# EAGLE design recco-rig (EAGLE 9.6.1)
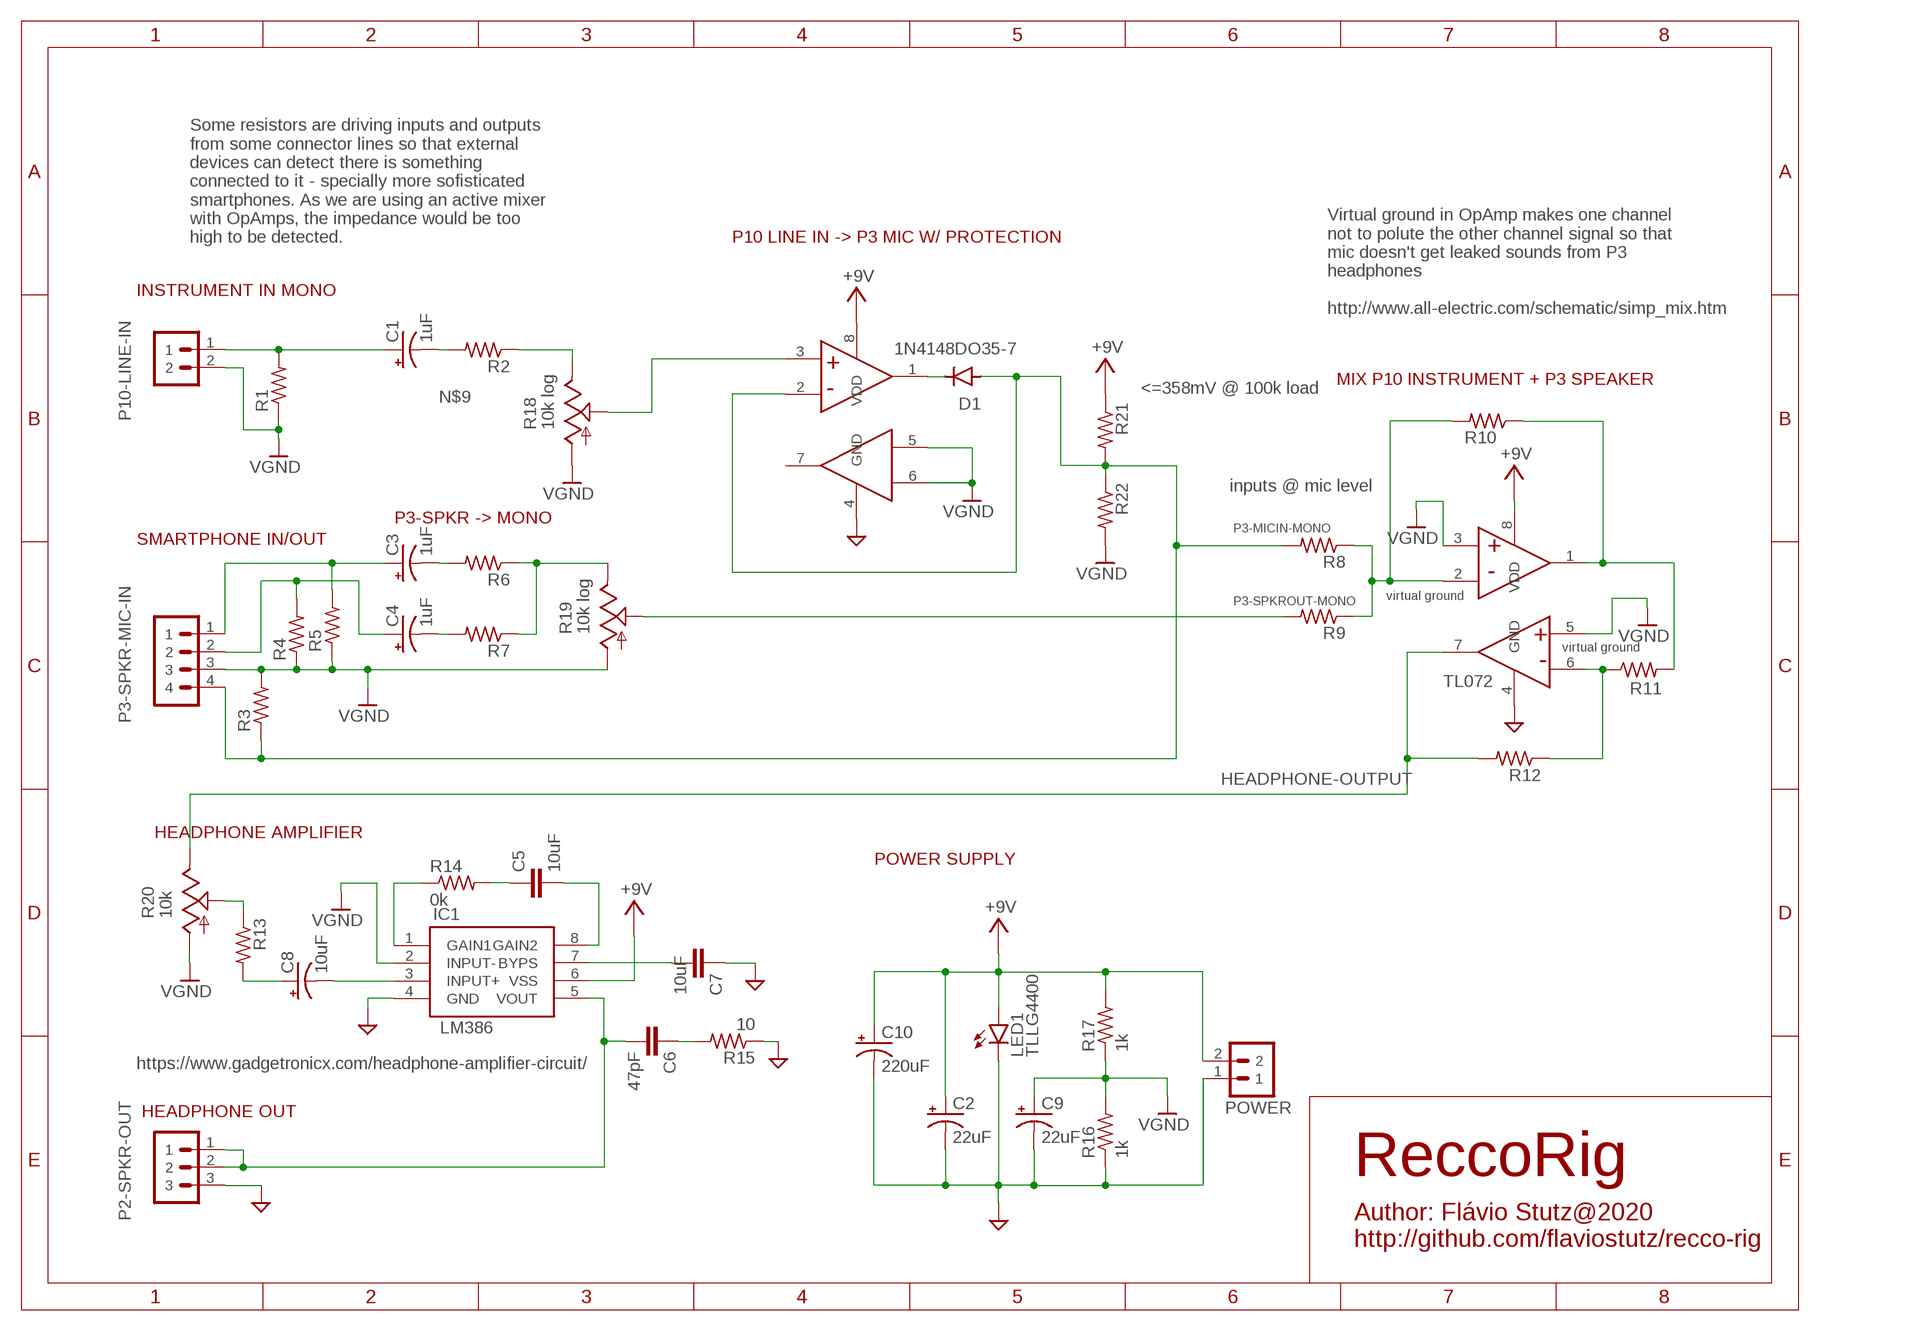
[diagram p0: schematic, sheet 1]

## Parts
C1  1uF  CPOL-USE2,5-6E  [E2,5-6E]
C2  22uF  CPOL-USE2,5-6E  [E2,5-6E]
C3  1uF  CPOL-USE2,5-6E  [E2,5-6E]
C4  1uF  CPOL-USE2,5-6E  [E2,5-6E]
C5  10uF  C-EU050-024X044  [C050-024X044]
C6  47pF  C-EU050-024X044  [C050-024X044]
C7  10uF  C-EU050-024X044  [C050-024X044]
C8  10uF  CPOL-USE2,5-6E  [E2,5-6E]
C9  22uF  CPOL-USE2,5-6E  [E2,5-6E]
C10  220uF  CPOL-USE2,5-6E  [E2,5-6E]
D1  1N4148DO35-7  [DO35-7]
IC1  LM386  [PDIP-8PIN]
IC2  TL072-OPAMP  [PDIP-8PIN]
LED1  TLLG4400  [LED3MM]
P2-SPKR-OUT  PIN-HEADER-3PIN  [PIN-HEADER-3PIN]
P3-SPKR-MIC-IN  PIN-HEADER-4PIN  [PIN-HEADER-4PIN]
P10-LINE-IN  PIN-HEADER-2PIN  [PIN-HEADER-2PIN]
POWER  PIN-HEADER-2PIN  [PIN-HEADER-2PIN]
R1  10k  RESISTORV1  [RESISTOR-V1]
R2  300  RESISTORV1  [RESISTOR-V1]
R3  1k  RESISTORV1  [RESISTOR-V1]
R4  1k  RESISTORV1  [RESISTOR-V1]
R5  1k  RESISTORV1  [RESISTOR-V1]
R6  300  RESISTORV1  [RESISTOR-V1]
R7  300  RESISTORV1  [RESISTOR-V1]
R8  10k  RESISTORV1  [RESISTOR-V1]
R9  10k  RESISTORV1  [RESISTOR-V1]
R10  10k  RESISTORV1  [RESISTOR-V1]
R11  10k  RESISTORV1  [RESISTOR-V1]
R12  10k  RESISTORV1  [RESISTOR-V1]
R13  100  RESISTORV1  [RESISTOR-V1]
R14  0k  R-US_0309/V  [0309V]
R15  10  R-US_0309/V  [0309V]
R16  1k  R-US_0309/V  [0309V]
R17  1k  R-US_0309/V  [0309V]
R18  10k log  TRIM_US-B25U  [B25U]
R19  10k log  TRIM_US-B25U  [B25U]
R20  10k  TRIM_US-B25U  [B25U]
R21  10k  RESISTORV1  [RESISTOR-V1]
R22  1k  RESISTORV1  [RESISTOR-V1]
U$12  TL072-OPAMP  [PDIP-8PIN]

## Nets
+9V [power]: C2.+ C10.+ IC1.6(VSS) IC2.8(VDD) LED1.A POWER.2 R17.2 R21.1 U$12.8(VDD)
GND [power]: C2.- C7.1 C9.- C10.- IC1.4(GND) IC2.4(GND) LED1.K(C) P2-SPKR-OUT.3 POWER.1 R15.1 R16.1 U$12.4(GND)
HEADPHONE-OUTPUT: IC2.7(2OUT) R12.2 R20.E
N$1: C1.- R2.2
N$2: C3.- R6.2
N$3: C4.- R7.2
N$4: IC2.2(1IN-) R8.1 R9.1 R10.2
N$5: IC2.1(1OUT) R10.1 R11.2
N$6: IC2.6(2IN-) R11.1 R12.1
N$7: C6.1 R15.2
N$8: C3.+ P3-SPKR-MIC-IN.1 R5.2
N$9: R2.1 R18.E
N$10: C8.+ R13.2
N$11: R13.1 R20.S
N$12: C5.2 IC1.8(GAIN2)
N$13: C5.1 R14.2
N$14: IC1.1(GAIN1) R14.1
N$15: C6.2 IC1.5(VOUT) P2-SPKR-OUT.1 P2-SPKR-OUT.2
N$16: C7.2 IC1.7(BYPS)
N$17: C8.- IC1.3(INPUT+)
N$18: R6.1 R7.1 R19.E
N$19: R18.S U$12.3(1IN+)
N$21: D1.C U$12.1(1OUT)
P3-MICIN-MONO: D1.A P3-SPKR-MIC-IN.4 R3.1 R8.2 R21.2 R22.1 U$12.2(1IN-)
P3-SPKROUT-MONO: R9.2 R19.S
P3-SPKROUT-R: C4.+ P3-SPKR-MIC-IN.2 R4.2
P10-LINEIN-MONO: C1.+ P10-LINE-IN.1 R1.2
VGND [power]: C9.+ IC1.2(INPUT-) IC2.3(1IN+) IC2.5(2IN+) P3-SPKR-MIC-IN.3 P10-LINE-IN.2 R1.1 R3.2 R4.1 R5.1 R16.2 R17.1 R18.A R19.A R20.A R22.2 U$12.5(2IN+) U$12.6(2IN-)
Unconnected: U$12.7(2OUT)

## Notes on the sheet
- Some resistors are driving inputs and outputs
  from some connector lines so that external
  devices can detect there is something
  connected to it - specially more sofisticated
  smartphones. As we are using an active mixer
  with OpAmps, the impedance would be too
  high to be detected.
- P10 LINE IN -> P3 MIC W/ PROTECTION
- INSTRUMENT IN MONO
- Virtual ground in OpAmp makes one channel
  not to polute the other channel signal so that
  mic doesn't get leaked sounds from P3
  headphones
  
  http://www.all-electric.com/schematic/simp_mix.htm
- +
- MIX P10 INSTRUMENT + P3 SPEAKER
- - | <=358mV @ 100k load
- inputs @ mic level
- P3-SPKR -> MONO
- SMARTPHONE IN/OUT
- +
- -
- virtual ground
- +
- virtual ground
- -
- TL072
- HEADPHONE AMPLIFIER
- POWER SUPPLY
- https://www.gadgetronicx.com/headphone-amplifier-circuit/
- HEADPHONE OUT
- ReccoRig
- Author: Flávio Stutz@2020
  http://github.com/flaviostutz/recco-rig

## Library data of the parts
C1-C4 C8-C10 = rcl:CPOL-US: POLARIZED CAPACITOR, American symbol; SPICEPREFIX: C
C5-C7 = resistor:C-EU: CAPACITOR, European symbol
D1 = diode:1N4148: DIODE high speed (Philips)
IC1 = stutz-components-library:LM386
IC2 = stutz-components-library:TL072-OPAMP; SPICEPREFIX: X
LED1 = led:TLLG4400: Low Current (2mA) LED 3 mm Tinted Diffused Package color GREEN Source: Data sheet <http://www.farnell.com/datasheets/391098.pdf>; MF: VISHAY SEMICONDUCTOR; OC_FARNELL: 1612435
P2-SPKR-OUT = stutz-components-library:PIN-HEADER-3PIN
P3-SPKR-MIC-IN = stutz-components-library:PIN-HEADER-4PIN
P10-LINE-IN POWER = stutz-components-library:PIN-HEADER-2PIN
R1-R3 R5-R13 R21 R22 = stutz-components-library:RESISTOR
R4 = stutz-components-library:RESISTOR; SPICEPREFIX: R
R14-R17 = rcl:R-US_: RESISTOR, American symbol; SPICEPREFIX: R
R18-R20 = pot:TRIM_US-: POTENTIOMETER
U$12 = stutz-components-library:TL072-OPAMP

## Net classes
0 default: width 0.61 mm
1 power: width 0.711 mm

## Board
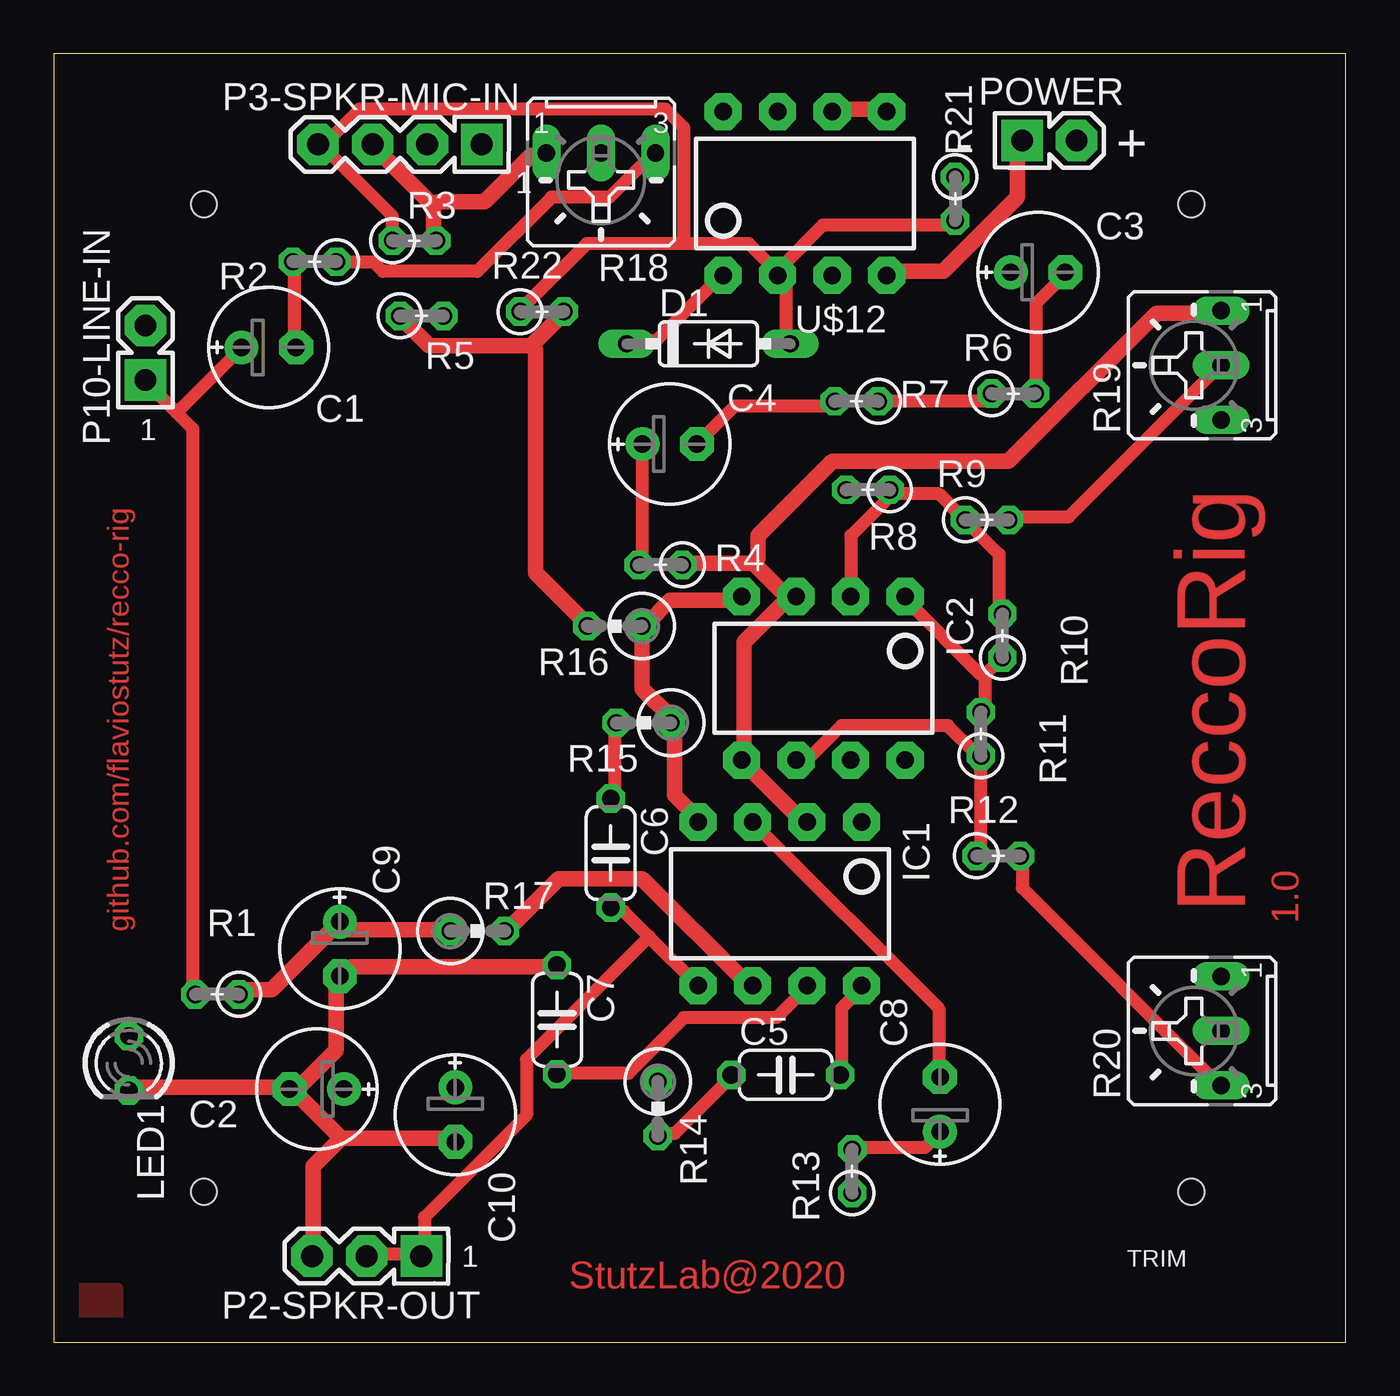
[diagram p1: board, top side]
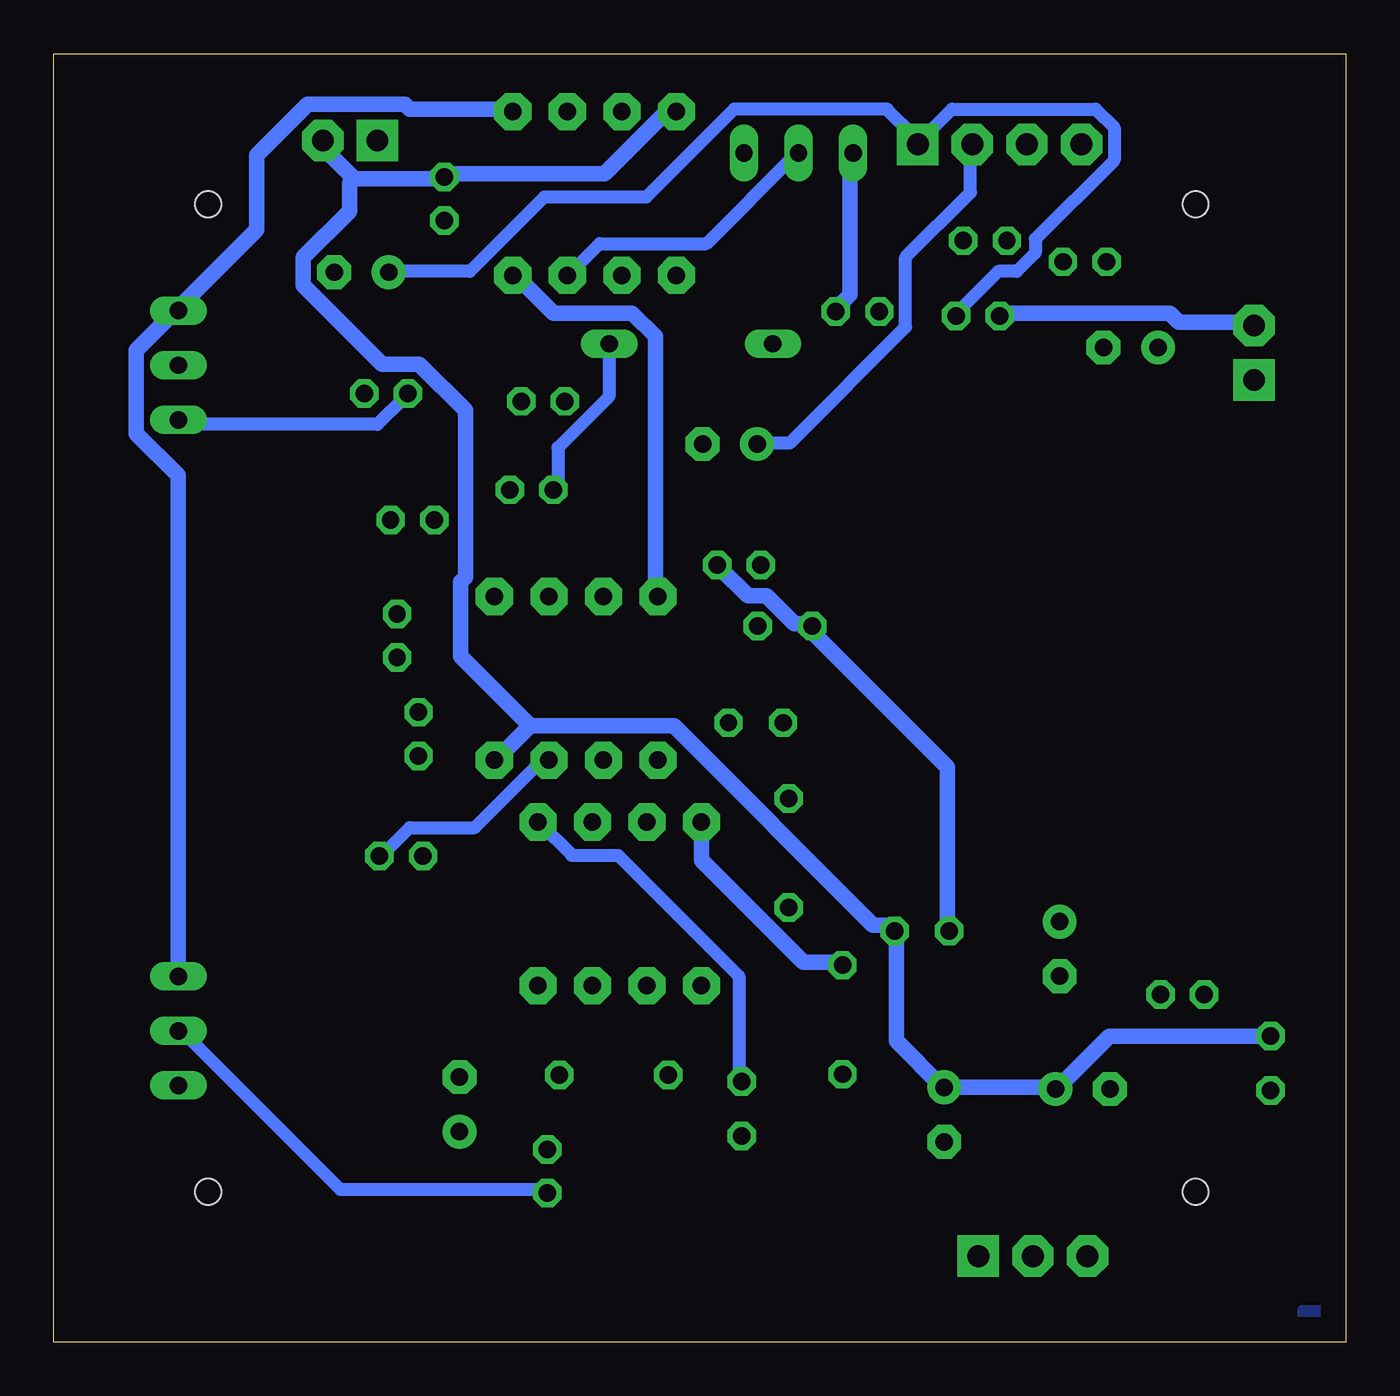
[diagram p2: board, bottom side, seen from below]

Size 60.2 x 60.01 mm. Coordinates in mm from the lower left corner, seen from the top.
Outline: 0,0 60.2,0 60.2,60.01 0,60.01 0,0
Copper layers (1*16): Top 0.035mm / dielectric 1.5mm / Bottom 0.035mm
Design rules "default *": minimum track width 10mil, minimum drill 0.35mm, track to track 10mil, track to pad 10mil, pad to pad 10mil, via to via 10mil, smd to smd 10mil, copper to edge 46mil, drill to drill 10mil, minimum pad ring 10mil, minimum via ring 8mil, stop-mask expansion 4mil, vias tented up to drill 0mil, thermal gap 10mil
Holes 1.2 mm at 7,7 53,7 53,53 7,53

### Footprints (pad centres in the part's own frame; a part is rotated, then mirrored left to right if it is on the bottom)
E2,5-6E = drill 0.813 pad 1.575: + -1.27,0 | drill 0.813 pad 1.575 octagon: - 1.27,0
C050-024X044 = drill 0.813 octagon: 1 -2.54,0; 2 2.54,0
DO35-7 = drill 0.813 long: A 3.81,0; C -3.81,0
PDIP-8PIN = drill 0.813 pad 1.727 octagon: 1 -3.81,-3.81; 2 -1.27,-3.81; 3 1.27,-3.81; 4 3.81,-3.81; 5 3.81,3.81; 6 1.27,3.81; 7 -1.27,3.81; 8 -3.81,3.81
LED3MM = drill 0.813 octagon: A -1.27,0; K 1.27,0
PIN-HEADER-3PIN = drill 1.016 pad 1.93 square: 1 -2.54,0 | drill 1.016 pad 1.93 octagon: 2 0,0; 3 2.54,0
PIN-HEADER-4PIN = drill 1.016 pad 1.93 square: 1 -3.81,0 | drill 1.016 pad 1.93 octagon: 2 -1.27,0; 3 1.27,0; 4 3.81,0
PIN-HEADER-2PIN = drill 1.016 pad 1.93 square: 1 -1.27,0 | drill 1.016 pad 1.93 octagon: 2 1.27,0
RESISTOR-V1 = drill 0.813 octagon: 1 -1.27,0; 2 0.762,0
0309V = drill 0.813 octagon: 1 -1.27,0; 2 1.27,0
B25U = drill 0.813 long: A 2.54,-0.889; E -2.54,-0.889; S 0,-0.889

### Placement (x,y rotation side)
C1  10.02,46.33 0 top
C2  12.26,11.79 180 top
C3  45.86,49.83 0 top
C4  28.7,41.83 0 top
C5  34.1,12.45 0 top
C6  25.95,22.78 270 top
C7  23.45,15.02 270 top
C8  41.29,11.08 90 top
C9  13.33,18.32 270 top
C10  18.71,10.6 270 top
D1  30.5,46.5 0 top
IC1  33.83,20.42 180 top
IC2  35.86,30.92 180 top
LED1  3.5,13 270 top
P2-SPKR-OUT  14.58,4.01 180 top
P3-SPKR-MIC-IN  16.13,55.79 180 top
P10-LINE-IN  4.28,46.08 90 top
POWER  46.39,55.97 0 top
R1  7.36,16.2 180 top
R2  11.91,50.32 180 top
R3  17.06,51.3 0 top
R4  28.02,36.2 180 top
R5  17.4,47.8 0 top
R6  44.97,44.18 0 top
R7  37.15,43.82 180 top
R8  37.68,39.7 180 top
R9  43.74,38.3 0 top
R10  44.2,33.16 90 top
R11  43.2,28.58 90 top
R12  44.26,22.65 0 top
R13  37.2,8.22 90 top
R14  28.15,10.87 270 top
R15  27.49,28.85 180 top
R16  26.13,33.35 180 top
R17  19.75,19.15 0 top
R18  25.5,54.5 180 top
R19  53.5,45.5 90 top
R20  53.5,14.5 90 top
R21  42,53 270 top
R22  23,48 0 top
U$12  35,53.5 0 top

### Tracks (layer width: path | path; a pad name or v marks a point on that pad's centre or on a via)
+9V
  Top 0.711: IC1.6 32.38,16.62 27.42,21.59 23.53,21.59 21.16,19.21 R17.2
  Bottom 0.711: 46.2,54.19 42.1,54.19 R21.1 41.67,54.41 34.54,54.41 31.74,57.21 31.3,57.21 U$12.8 | 46.2,54.19 47.5,55.49 47.5,55.92 POWER.2 | LED1.A 3.67,14.25 11.01,14.25 13.39,11.87 C2.+ 13.82,11.87 18.57,11.87 C10.+ 18.78,11.87 20.94,14.03 20.94,19 R17.2 21.16,19.43 22.02,19.43 31.3,28.71 38,28.71 | 38,28.71 39.51,27.2 IC2.8 | 38,28.71 41.24,31.95 41.24,35.41 41.02,35.62 41.02,43.4 43.18,45.55 44.91,45.55 48.58,49.23 48.58,50.52 46.42,52.68 46.42,53.98 46.2,54.19
GND
  Top 0.711: C7.1 23.32,17.49 13.82,17.49 13.39,17.06 C9.- 13.17,16.84 13.17,13.6 11.44,11.87 C2.- | LED1.K 3.67,11.87 10.79,11.87 C2.- | 13.39,9.5 18.57,9.5 C10.- | 13.39,9.5 11.23,11.66 C2.- | 13.39,9.5 12.09,8.2 12.09,4.1 P2-SPKR-OUT.3 | U$12.4 38.86,49.87 41.45,49.87 44.91,53.33 44.91,55.92 POWER.1 | IC1.4 30.01,24.4 28.93,25.48 28.93,28.71 R15.1 28.71,29.15 27.42,30.44 27.42,33.25 R16.1 27.64,33.47 28.71,34.54 31.95,34.54 IC2.4
  Bottom 0.711: U$12.4 38.65,49.66 36.92,47.93 33.25,47.93 32.17,46.85 32.17,34.76 IC2.4 | C7.1 23.53,17.7 25.26,17.7 30.01,22.45 30.01,24.18 IC1.4
HEADPHONE-OUTPUT
  Top 0.61: R20.E 54.19,12.09 45.12,21.16 45.12,22.45 R12.2
  Bottom 0.61: IC2.7 37.13,26.99 37.57,26.99 40.59,23.96 43.61,23.96 44.91,22.67 R12.2
N$1
  Top 0.61: R2.2 11.23,50.3 11.23,46.42 C1.-
N$2
  Top 0.61: R6.2 45.77,44.26 45.77,48.36 47.07,49.66 C3.-
N$3
  Top 0.61: R7.2 36.27,43.61 31.74,43.61 30.01,41.88 C4.-
N$4
  Top 0.61: R10.2 44.04,34.11 44.04,36.7 42.53,38.21 R9.1 42.32,38.43 41.24,39.51 39.08,39.51 R8.1 38.86,39.29 37.13,37.57 37.13,34.76 IC2.2
N$5
  Top 0.61: 43.4,31.09 43.4,29.36 R11.2 | 43.4,31.09 44.04,31.74 R10.1 | IC2.1 39.73,34.54 43.18,31.09 43.4,31.09
N$6
  Top 0.61: R12.1 43.18,22.67 43.18,27.2 R11.1 42.96,27.42 41.67,28.71 36.7,28.71 35.19,27.2 34.76,27.2 IC2.6
N$7
  Top 0.61: C6.1 26.12,25.48 26.12,28.71 R15.2
N$8
  Bottom 0.61: R5.2 18.14,47.93 16.19,49.87 15.33,49.87 14.46,50.74 14.46,51.38 10.79,55.05 10.79,56.57 11.66,57.43 18.35,57.43 19.86,55.92 P3-SPKR-MIC-IN.1 20.08,56.13 21.37,57.43 28.5,57.43 32.6,53.33 37.35,53.33 40.8,49.87 44.48,49.87 C3.+
N$9
  Top 0.61: R2.1 13.39,50.3 14.9,50.3 15.33,49.87 19.74,49.87 23.19,53.33 25.91,53.33 27.85,55.27 R18.E
N$10
  Top 0.61: R13.2 37.35,9.07 40.59,9.07 41.24,9.72 C8.+
N$11
  Bottom 0.61: R13.1 37.35,7.12 46.85,7.12 54.19,14.46 R20.S
N$12
  Top 0.61: C5.2 36.7,12.52 36.7,15.54 37.57,16.41 IC1.8
N$13
  Top 0.61: R14.2 28.28,9.72 28.93,9.72 31.52,12.31 C5.1
N$14
  Bottom 0.61: R14.1 28.28,12.31 28.28,17.06 33.9,22.67 36.05,22.67 37.57,24.18 IC1.1
N$15
  Top 0.61: P2-SPKR-OUT.2 14.68,4.1 17.06,4.1 P2-SPKR-OUT.1 17.27,4.32 17.27,5.83 22.02,10.58 22.02,13.17 27.74,18.89 | 27.74,18.89 30.01,16.62 IC1.5 | 27.74,18.89 26.56,20.08 26.12,20.08 C6.2
N$16
  Top 0.61: C7.2 23.53,12.52 26.77,12.52 29.36,15.11 33.68,15.11 34.98,16.41 IC1.7
N$17
  Top 0.61: C8.- 41.24,12.52 41.24,15.54 32.6,24.18 IC1.3
N$18
  Top 0.61: R7.1 43.4,43.83 43.61,44.04 R6.1
  Bottom 0.61: R19.E 54.19,42.75 45.12,42.75 43.83,44.04 R6.1
N$19
  Bottom 0.61: R18.S 25.69,55.27 29.79,51.17 34.76,51.17 36.05,49.87 U$12.3
N$21
  Top 0.61: D1.C 26.77,46.63 28.07,46.63 31.09,49.66 U$12.1
P3-MICIN-MONO
  Top 0.61: R3.1 15.76,51.38 15.76,52.46 12.52,55.7 P3-SPKR-MIC-IN.4 12.74,55.92 14.25,57.43 28.5,57.43 29.36,56.57 29.36,51.17 | 29.36,51.17 32.38,51.17 33.68,49.87 U$12.2 | 29.36,51.17 24.83,51.17 21.81,48.15 R22.1 | D1.A 34.11,46.63 34.11,49.23 33.9,49.44 U$12.2 | R21.2 41.88,52.03 35.84,52.03 33.9,50.09 U$12.2
  Bottom 0.61: R8.2 36.7,39.73 36.7,41.67 34.33,44.04 34.33,46.42 D1.A
P3-SPKROUT-MONO
  Top 0.61: R9.2 44.69,38.43 47.28,38.43 54.19,45.34 R19.S
P3-SPKROUT-R
  Top 0.61: R4.2 27.42,36.27 27.42,41.67 C4.+
  Bottom 0.61: P3-SPKR-MIC-IN.2 17.49,55.7 17.49,53.54 20.51,50.52 20.51,47.28 25.91,41.88 27.42,41.88 C4.+
P10-LINEIN-MONO
  Top 0.61: 5.72,43.29 4.32,44.69 P10-LINE-IN.1 | 5.72,43.29 6.48,42.53 6.48,16.41 R1.2 | 5.72,43.29 8.64,46.2 C1.+
VGND
  Top 0.711: U$12.6 36.27,57.43 38.65,57.43 U$12.5 | 17.7,52.9 17.7,51.38 R3.2 | 17.7,52.9 14.9,55.7 P3-SPKR-MIC-IN.3 | R18.A 22.89,55.27 22.24,55.27 20.08,53.11 17.92,53.11 17.7,52.9 | 22.24,46.42 17.49,46.42 16.19,47.71 R5.1 | 22.24,46.42 23.75,47.93 R22.2 | R1.1 8.64,16.41 10.15,16.41 13.17,19.43 C9.+ 13.39,19.21 18.35,19.21 R17.1 | IC1.2 34.98,24.18 32.17,26.99 IC2.5 32.17,27.42 32.17,32.6 34.11,34.54 IC2.3 34.54,34.76 34.11,34.76 32.6,36.27 | 32.6,36.27 29.36,36.27 R4.1 | 22.24,46.42 22.45,46.2 22.45,35.84 24.83,33.47 R16.2 | R19.A 54.19,47.93 51.38,47.93 44.48,41.02 36.27,41.02 32.82,37.57 32.82,36.49 32.6,36.27
  Bottom 0.711: R20.A 54.41,17.06 54.41,40.37 56.35,42.32 56.35,46.2 54.41,48.15 R19.A 54.19,48.36 50.74,51.82 50.74,55.27 48.36,57.65 43.83,57.65 43.61,57.43 38.86,57.43 U$12.5 | P10-LINE-IN.2 4.32,47.5 7.77,47.5 8.2,47.93 15.98,47.93 R5.1 | R18.A 23.1,55.27 23.1,48.79 23.75,48.15 R22.2 | R4.1 29.15,36.05 27.85,34.76 26.99,34.76 25.69,33.47 25.04,33.47 R16.2 24.83,33.03 18.57,26.77 18.57,19.21 R17.1
  pour Top: 0,2.5 0,0 3,0 3,2.5
  pour Bottom: -1,1.5 -1,-1 2,-1 2,1.5

### Text on the board
Top: github.com/flaviostutz/recco-rig | ReccoRig | 1.0 | StutzLab@2020
tNames: - | + | 1 | 1 | 1 | TRIM